# EasyEDA Pro project 407vet6_imu_car.eprj, schematic 1.3寸（240*240）ips屏st7789驱动板
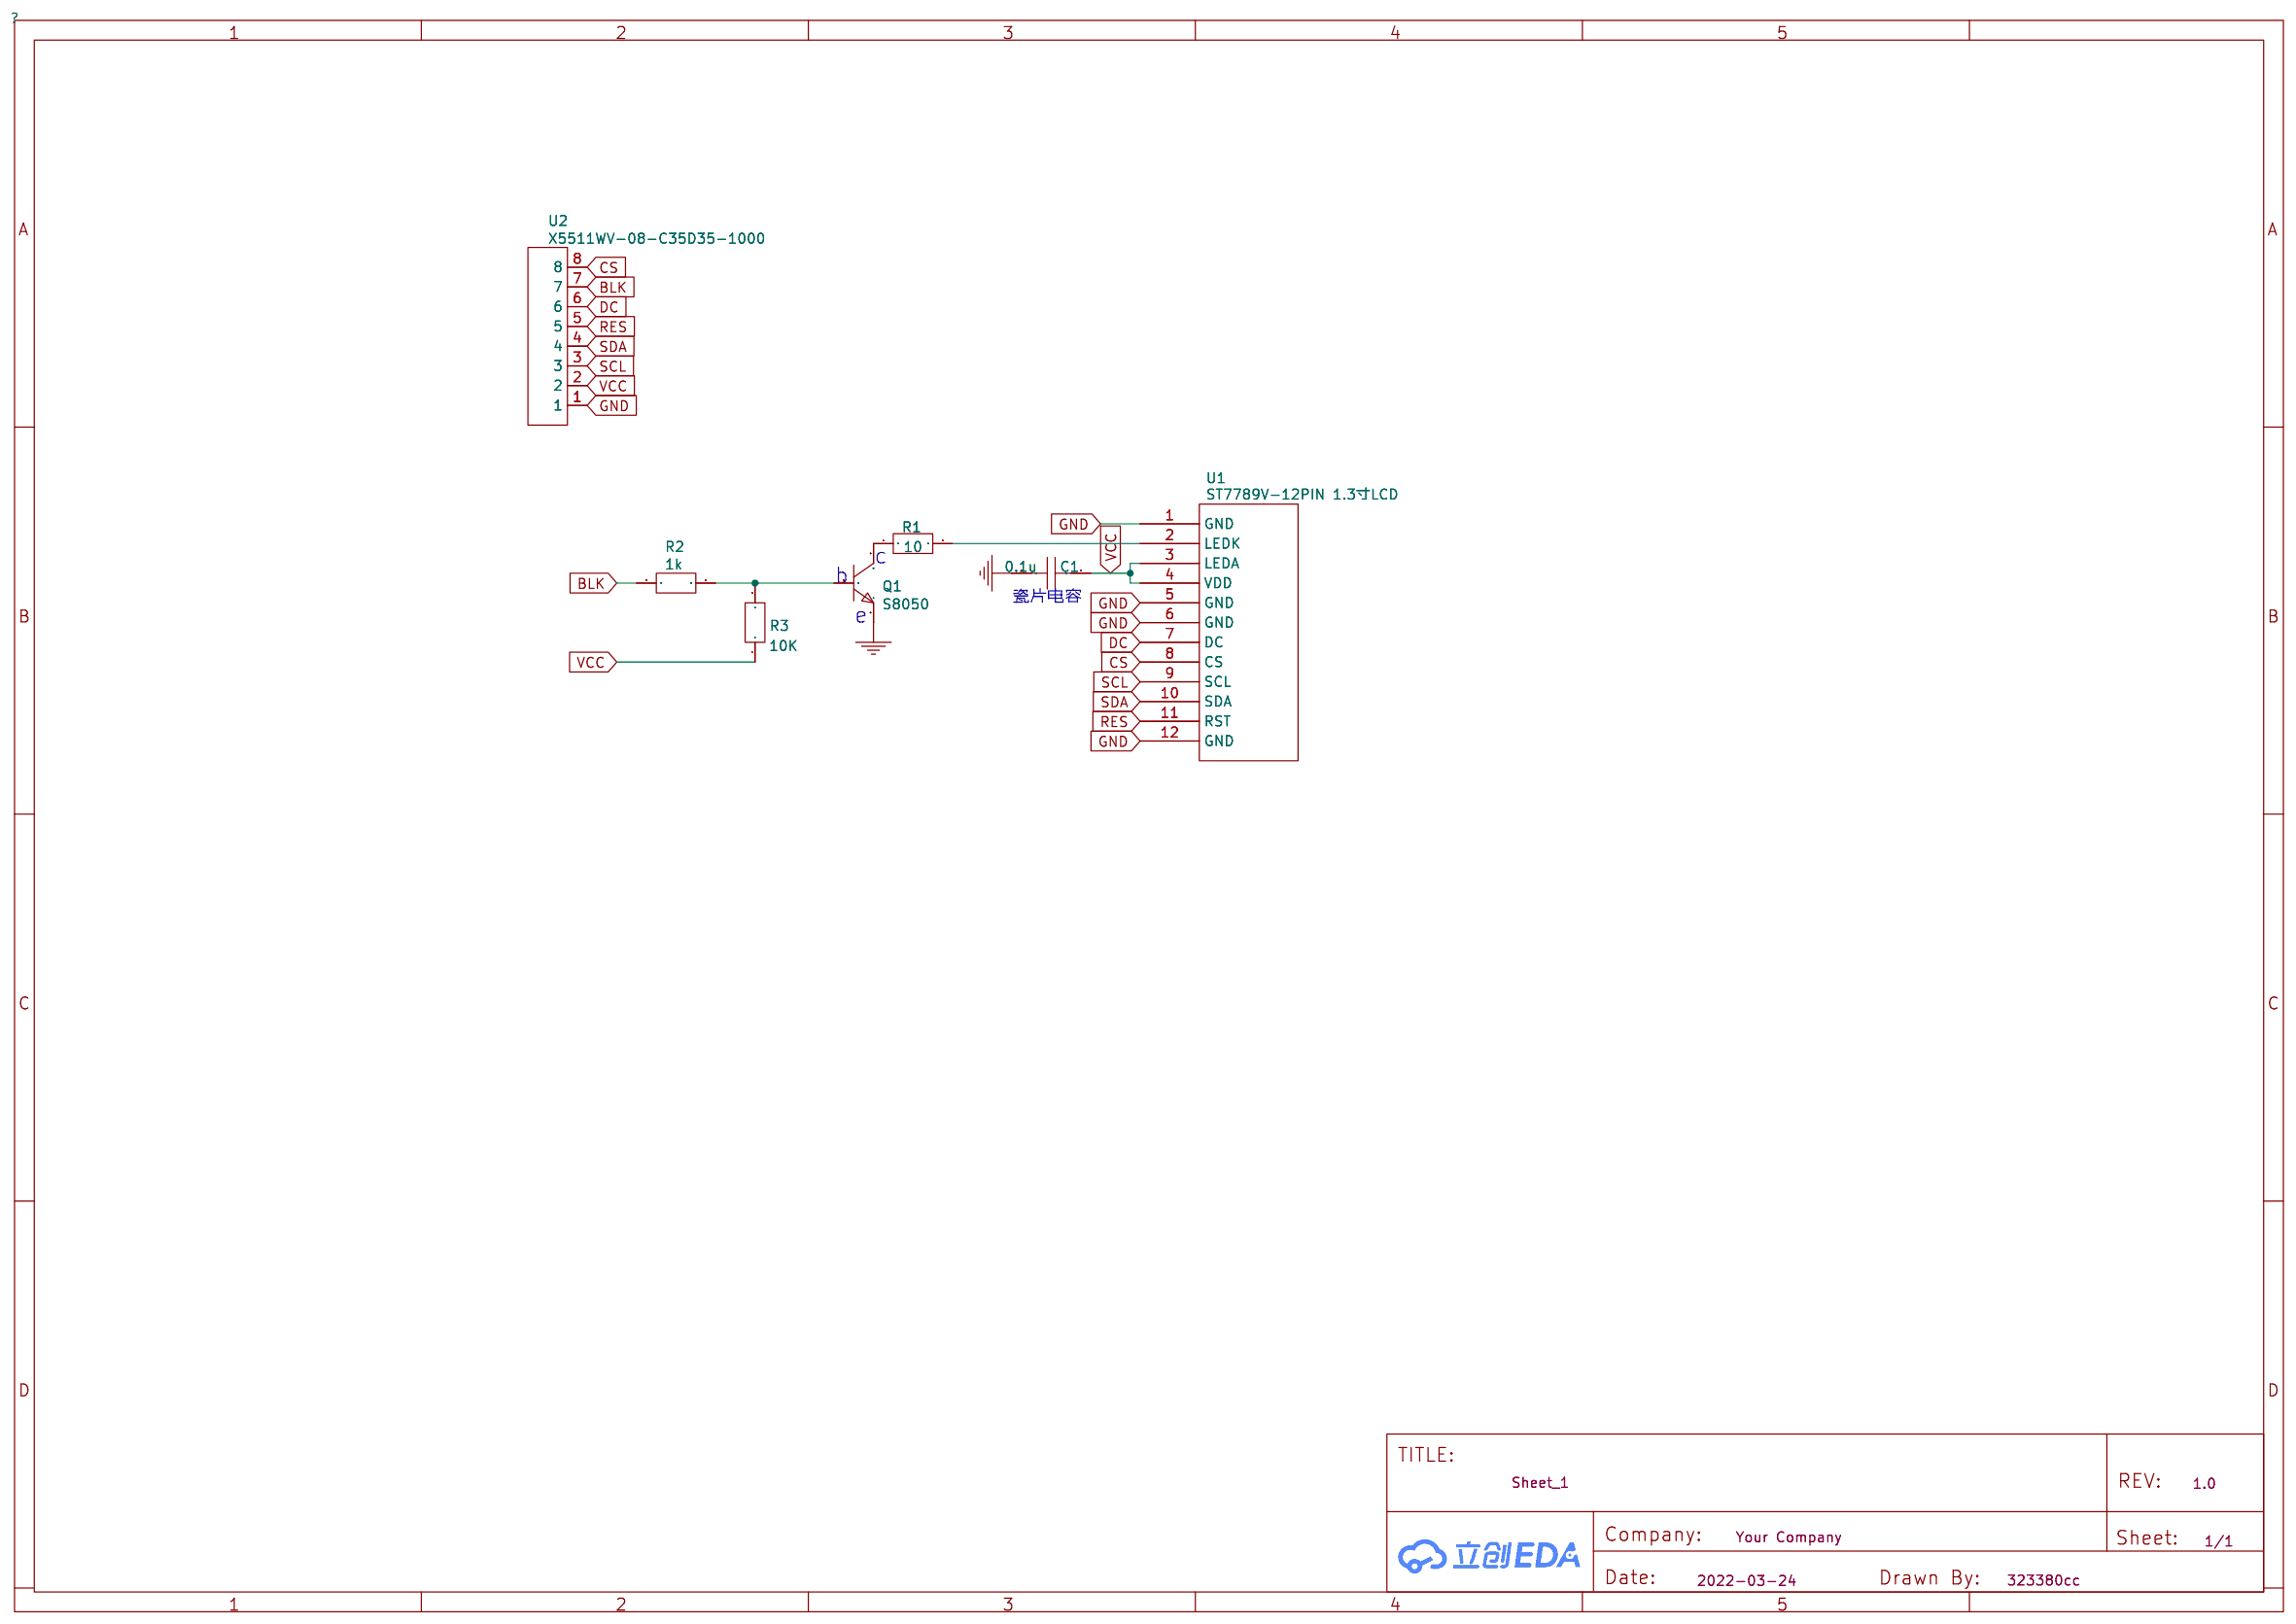
[diagram p1: schematic sheet]

## Parts
C1  0.1u  [C0805]
Q1  S8050  [SS8050-F722]
R1  10  [R0805]
R2  1k  [R0805]
R3  10K  [R0805]
U1  ST7789V-12PIN 1.3寸LCD  [ST7789V-12PIN]
U2  X5511WV-08-C35D35-1000  [HDR-TH_8P-P2.54-V-M]

## Library data of the parts
C1 = 0.1u
Q1 = S8050: Supplier: LCSC; Supplier Part: C388537; Manufacturer: Yangzhou Yangjie Elec Tech; Manufacturer Part: SS8050H; JLCPCB Part Class: Extended Part
R1 = 10
R2 = 1k
R3 = 10K
U1 = ST7789V-12PIN 1.3寸LCD: link: https://item.taobao.com/item.htm?spm=a1z09.2.0.0.223f2e8dx10dqp&amp;id=565306950948&amp;_u=o1u069vf46a
U2 = X5511WV-08-C35D35-1000: Supplier: LCSC; Supplier Part: C2883434; Manufacturer: XKB Connectivity(中国星坤); JLCPCB Part Class: Extended Part

## Nets
GND: C1.1 Q1.2(E) U1.1(GND) U1.5(GND) U1.6(GND) U1.12(GND) U2.1
VCC: C1.2 R3.1 U1.3(LEDA) U1.4(VDD) U2.2
BLK: R2.1 U2.7
CS: U1.8(CS) U2.8
DC: U1.7(DC) U2.6
RES: U1.11(RST) U2.5
SCL: U1.9(SCL) U2.3
SDA: U1.10(SDA) U2.4
Q1_1: Q1.1(B) R2.2 R3.2
Q1_3: Q1.3(C) R1.1
R1_2: R1.2 U1.2(LEDK)

## Notes on the sheet
- c
- b
- 瓷片电容
- e
